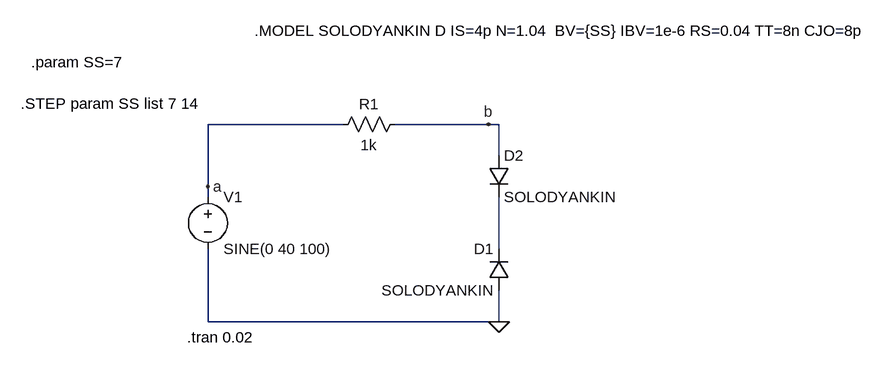
[diagram p0: schematic Draft2_2.asc]
Draft2_2.asc, the LTspice schematic file:
Version 4
SHEET 1 1124 680
WIRE 144 176 -64 176
WIRE 368 176 224 176
WIRE 384 176 368 176
WIRE 384 224 384 176
WIRE -64 272 -64 176
WIRE -64 288 -64 272
WIRE 384 368 384 288
WIRE -64 480 -64 368
WIRE 384 480 384 432
WIRE 384 480 -64 480
FLAG 384 480 0
FLAG -64 272 a
FLAG 368 176 b
SYMBOL diode 400 432 R180
WINDOW 0 24 64 Left 2
WINDOW 3 24 0 Left 2
SYMATTR InstName D1
SYMATTR Value SOLODYANKIN
SYMBOL voltage -64 272 R0
WINDOW 123 0 0 Left 2
WINDOW 39 0 0 Left 2
SYMATTR InstName V1
SYMATTR Value SINE(0 40 100)
SYMBOL res 240 160 R90
WINDOW 0 0 56 VBottom 2
WINDOW 3 32 56 VTop 2
SYMATTR InstName R1
SYMATTR Value 1k
SYMBOL diode 368 224 R0
SYMATTR InstName D2
SYMATTR Value SOLODYANKIN
TEXT 8 32 Left 2 !.MODEL SOLODYANKIN D IS=4p N=1.04  BV={SS} IBV=1e-6 RS=0.04 TT=8n CJO=8p
TEXT -96 504 Left 2 !.tran 0.02
TEXT -336 80 Left 2 !.param SS=7
TEXT -352 144 Left 2 !.STEP param SS list 7 14

The netlist it stands for:
* Draft2_2.asc
D1 0 N001 SOLODYANKIN
V1 a 0 SINE(0 40 100)
R1 b a 1k
D2 b N001 SOLODYANKIN
.model D D
.lib standard.dio
.MODEL SOLODYANKIN D IS=4p N=1.04  BV={SS} IBV=1e-6 RS=0.04 TT=8n CJO=8p
.tran 0.02
.param SS=7
.STEP param SS list 7 14
.backanno
.end